# EasyEDA Pro project rhythkey_V1.eprj

# Schematic Schematic1
Board Name: Board1; Create Date: 2024-12-12; Page Name: P1; Project Name: rhythkey_V1; Schematic Name: Schematic1; Update Date: 2024-12-18; Company: 嘉立创EDA; Page Size: A4; Version: V1.0
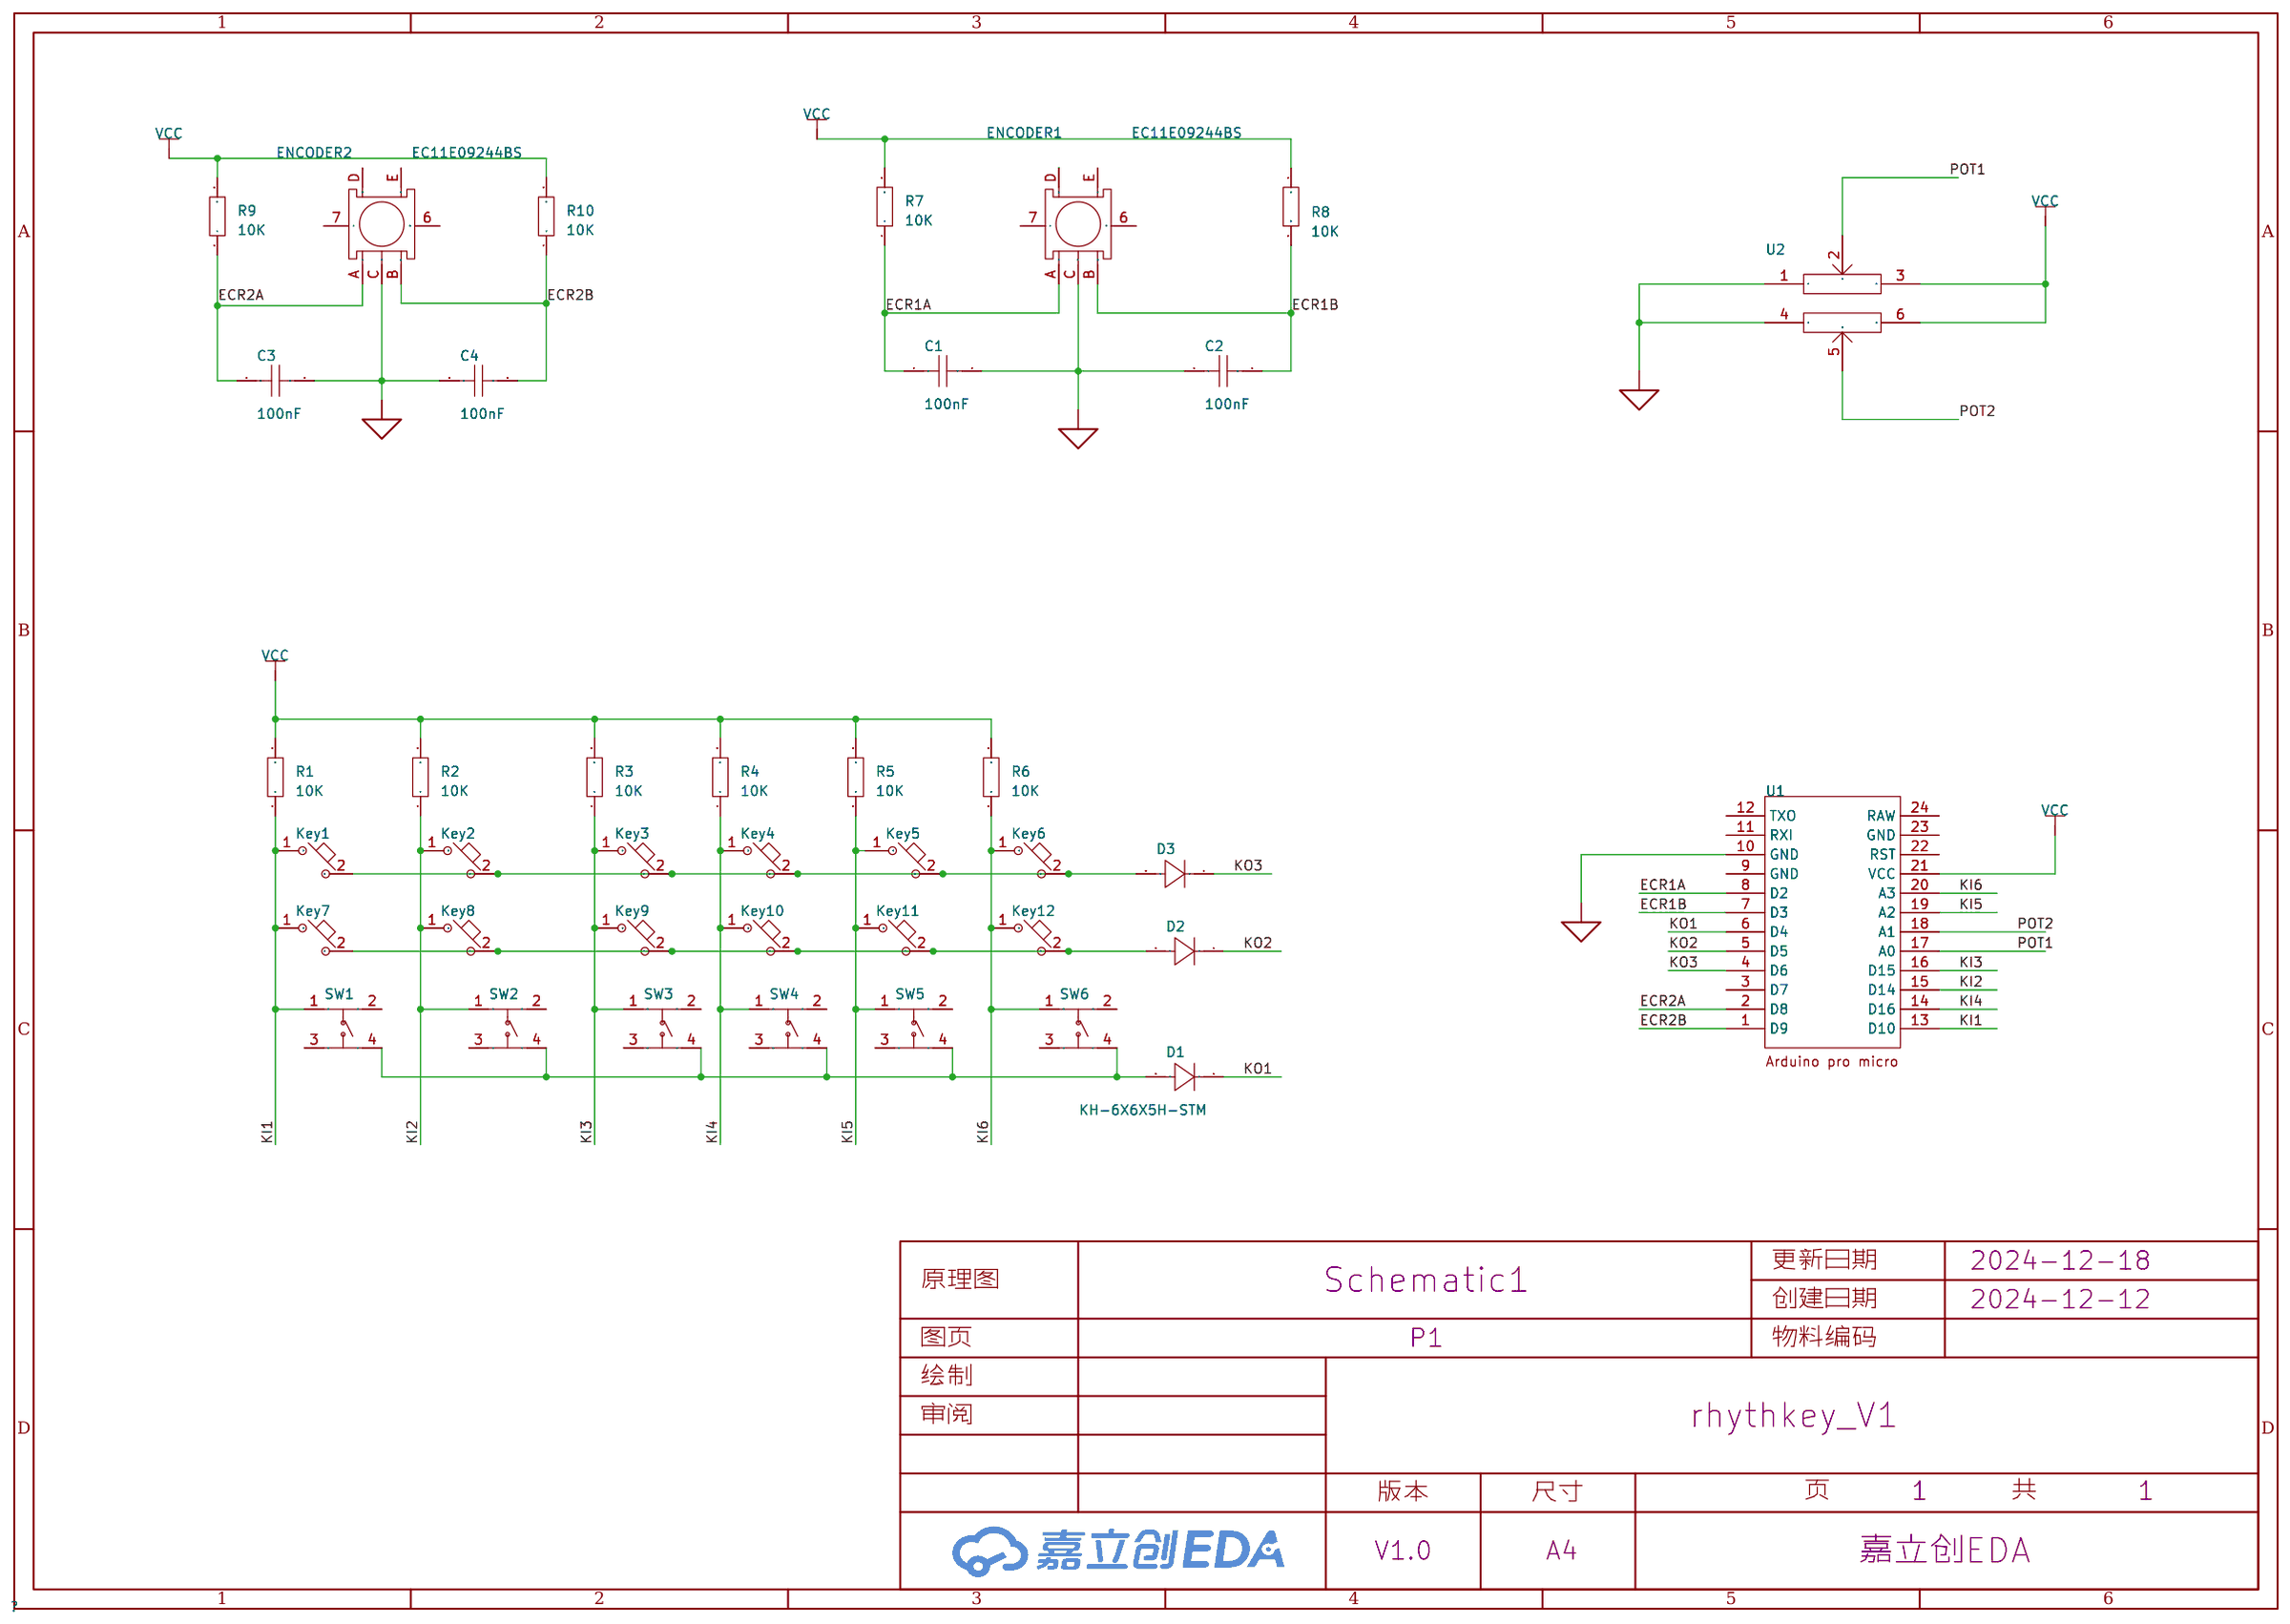
[diagram p0: schematic sheet]

## Parts
C1  100nF  [C0805]
C2  100nF  [C0805]
C3  100nF  [C0805]
C4  100nF  [C0805]
D1  -  [SMA_1N4007]
D2  -  [SMA_1N4007]
D3  -  [SMA_1N4007]
ENCODER1  EC11E09244BS  [SW-TH_EC11XXXXXXXX]
ENCODER2  EC11E09244BS  [SW-TH_EC11XXXXXXXX]
Key1  -  [轴座_焊接热插拔_不带灯]
Key2  -  [轴座_焊接热插拔_不带灯]
Key3  -  [轴座_焊接热插拔_不带灯]
Key4  -  [轴座_焊接热插拔_不带灯]
Key5  -  [轴座_焊接热插拔_不带灯]
Key6  -  [轴座_焊接热插拔_不带灯]
Key7  -  [轴座_焊接热插拔_不带灯]
Key8  -  [轴座_焊接热插拔_不带灯]
Key9  -  [轴座_焊接热插拔_不带灯]
Key10  -  [轴座_焊接热插拔_不带灯]
Key11  -  [轴座_焊接热插拔_不带灯]
Key12  -  [轴座_焊接热插拔_不带灯]
R1  10K  [R0805]
R2  10K  [R0805]
R3  10K  [R0805]
R4  10K  [R0805]
R5  10K  [R0805]
R6  10K  [R0805]
R7  10K  [R0805]
R8  10K  [R0805]
R9  10K  [R0805]
R10  10K  [R0805]
SW1  KH-6X6X5H-STM  [SW-SMD_4P-L6.0-W6.0-P4.50-LS9.0-2]
SW2  KH-6X6X5H-STM  [SW-SMD_4P-L6.0-W6.0-P4.50-LS9.0-2]
SW3  KH-6X6X5H-STM  [SW-SMD_4P-L6.0-W6.0-P4.50-LS9.0-2]
SW4  KH-6X6X5H-STM  [SW-SMD_4P-L6.0-W6.0-P4.50-LS9.0-2]
SW5  KH-6X6X5H-STM  [SW-SMD_4P-L6.0-W6.0-P4.50-LS9.0-2]
SW6  KH-6X6X5H-STM  [SW-SMD_4P-L6.0-W6.0-P4.50-LS9.0-2]
U1  -  [arduino_pro_micro]
U2  -  [75mm 滑台电位器]

## Library data of the parts
C1-C4 = CAP_0805: Supplier Footprint: 0805
D1-D3 = D_1N4007: Supplier Footprint: SMA
ENCODER1 ENCODER2 = EC11E09244BS: Supplier Part: C470742; Manufacturer: ALPSALPINE(阿尔卑斯阿尔派); Supplier Footprint: 插件; JLCPCB Part Class: 扩展库; Datasheet: https://atta.szlcsc.com/upload/public/pdf/source/20191216/C470795_DE763ECE59BD49533DB26DB53E5D34B2.pdf; Supplier: LCSC
Key1-Key12 = 5脚轴座
R1-R6 = Res_0603: Supplier Footprint: 0603
R7-R10 = Res_0805: Supplier Footprint: 0805
SW1-SW6 = KH-6X6X5H-STM: LCSC Part Name: 6*6*5mm 立贴 轻触开关; Supplier Part: C2837531; Manufacturer: kinghelm(金航标); Supplier Footprint: SMD; JLCPCB Part Class: 扩展库; Datasheet: https://atta.szlcsc.com/upload/public/pdf/source/20210608/C2837531_45E87AB996CE723B09405FF2EA209C4C.pdf; Supplier: LCSC; Circuit: 单刀单掷; Actuator Style: 圆形按钮; Mounting Style: 立贴; Switch Length: 6mm; Switch Width: 6mm; Switch Height: 5mm; Strike Gundam: 不带; Contact Current: 50mA; Voltage Rating (DC): 12V; Actuator/Cap Color: 黑色; Pin Style: 鸥翼型; Mechanical Life: 8万次
U1 = arduino_pro_micro: URL: https://www.sparkfun.com/products/12640
U2 = 75mm直滑电位器

## Nets
AGND: C1.2 C2.1 C3.2 C4.1 ENCODER1.C ENCODER2.C U1.10(GND) U2.1 U2.4
VCC: R1.2 R2.2 R3.2 R4.2 R5.2 R6.2 R7.2 R8.1 R9.2 R10.2 U1.21(VCC) U2.3(2) U2.6(3)
ECR1A: C1.1 ENCODER1.A R7.1 U1.8(D2)
ECR1B: C2.2 ENCODER1.B R8.2 U1.7(D3)
ECR2A: C3.1 ENCODER2.A R9.1 U1.2(D8)
ECR2B: C4.2 ENCODER2.B R10.1 U1.1(D9)
KI1: Key1.1(2) Key7.1(2) R1.1 SW1.1 U1.13(D10)
KI2: Key2.1(2) Key8.1(2) R2.1 SW2.1 U1.15(D14)
KI3: Key3.1(2) Key9.1(2) R3.1 SW3.1 U1.16(D15)
KI4: Key4.1(2) Key10.1(2) R4.1 SW4.1 U1.14(D16)
KI5: Key5.1(2) Key11.1(2) R5.1 SW5.1 U1.19(A2)
KI6: Key6.1(2) Key12.1(2) R6.1 SW6.1 U1.20(A3)
KO1: D1.1(K) U1.6(D4)
KO2: D2.1(K) U1.5(D5)
KO3: D3.1(K) U1.4(D6)
POT1: U1.17(A0) U2.2(5)
POT2: U1.18(A1) U2.5(6)
$1N1479: D3.2(A) Key1.2(1) Key2.2(1) Key3.2(1) Key4.2(1) Key5.2(1) Key6.2(1)
$1N1489: D2.2(A) Key7.2(1) Key8.2(1) Key9.2(1) Key10.2(1) Key11.2(1) Key12.2(1)
$1N6551: D1.2(A) SW1.4 SW2.4 SW3.4 SW4.4 SW5.4 SW6.4

Not connected (* = marked no-connect by the designer): ENCODER1 6 7 D E; ENCODER2 6 7 D E; SW1 2 3; SW2 2 3; SW3 2 3; SW4 2 3; SW5 2 3; SW6 2 3; U1 3(D7) 9(GND) 11(RXI) 12(TXO) 22(RST) 23(GND) 24(RAW)

# Board PCB1
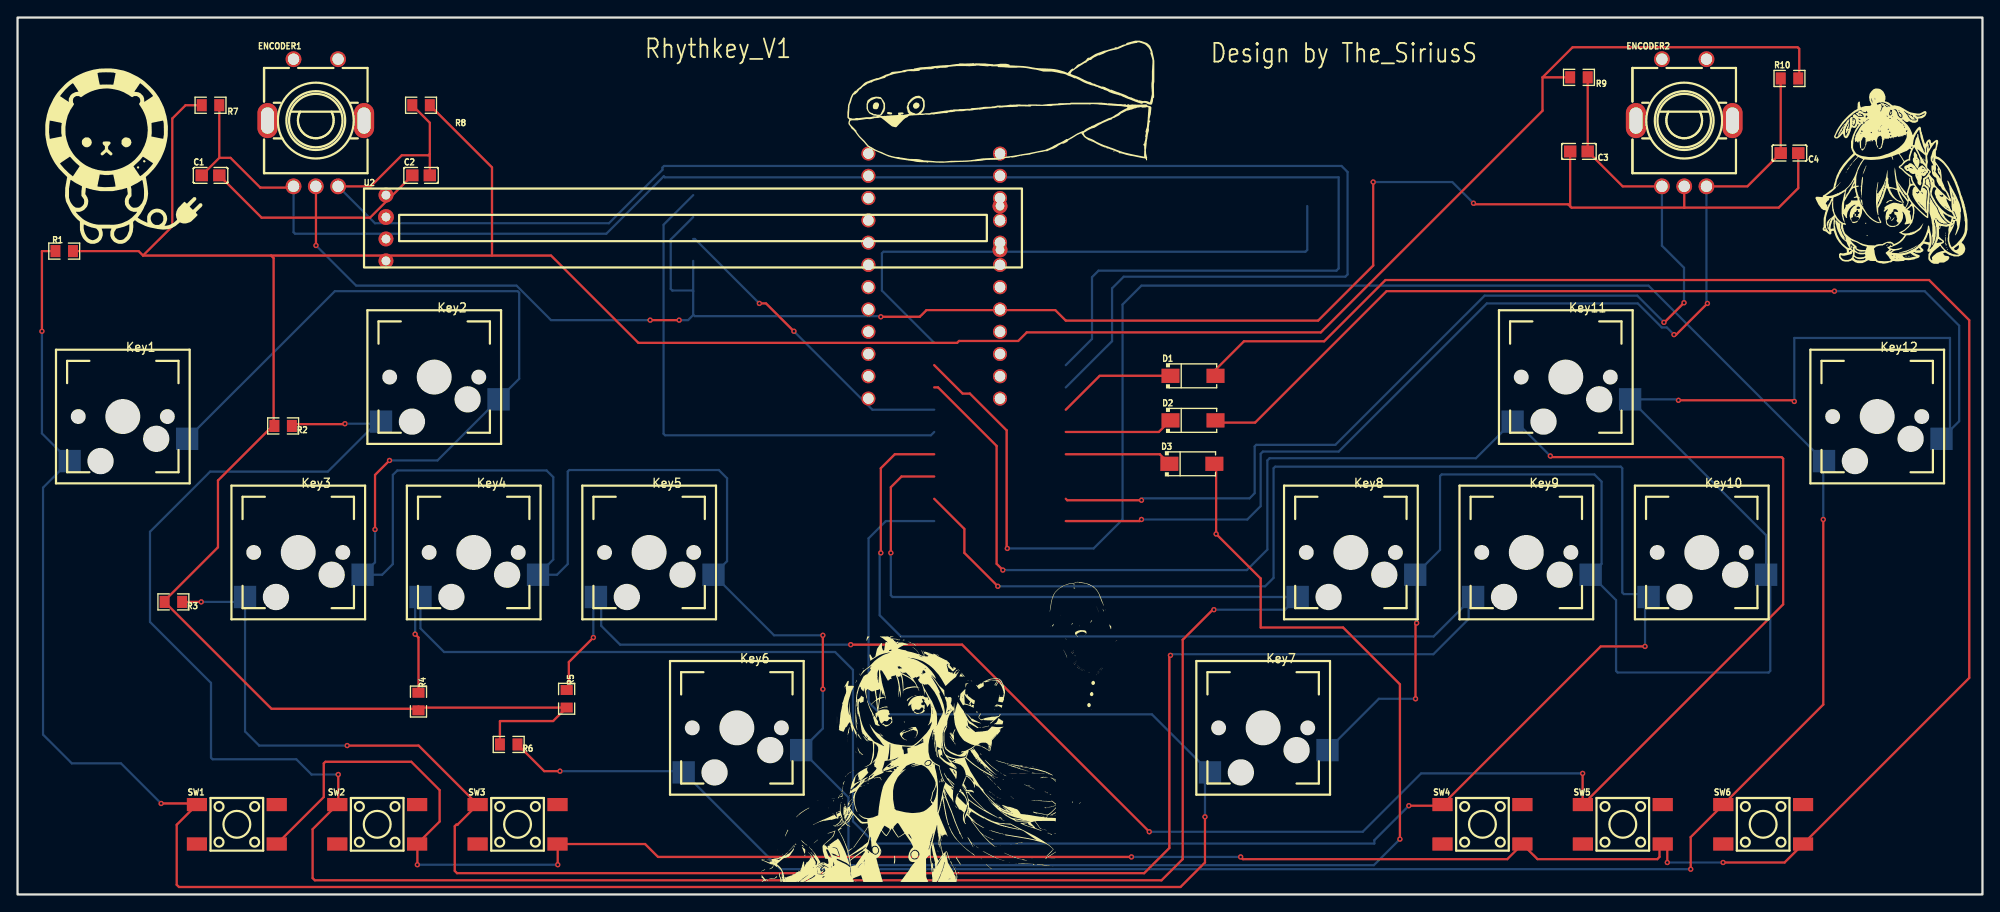
[diagram p1: board, top side]
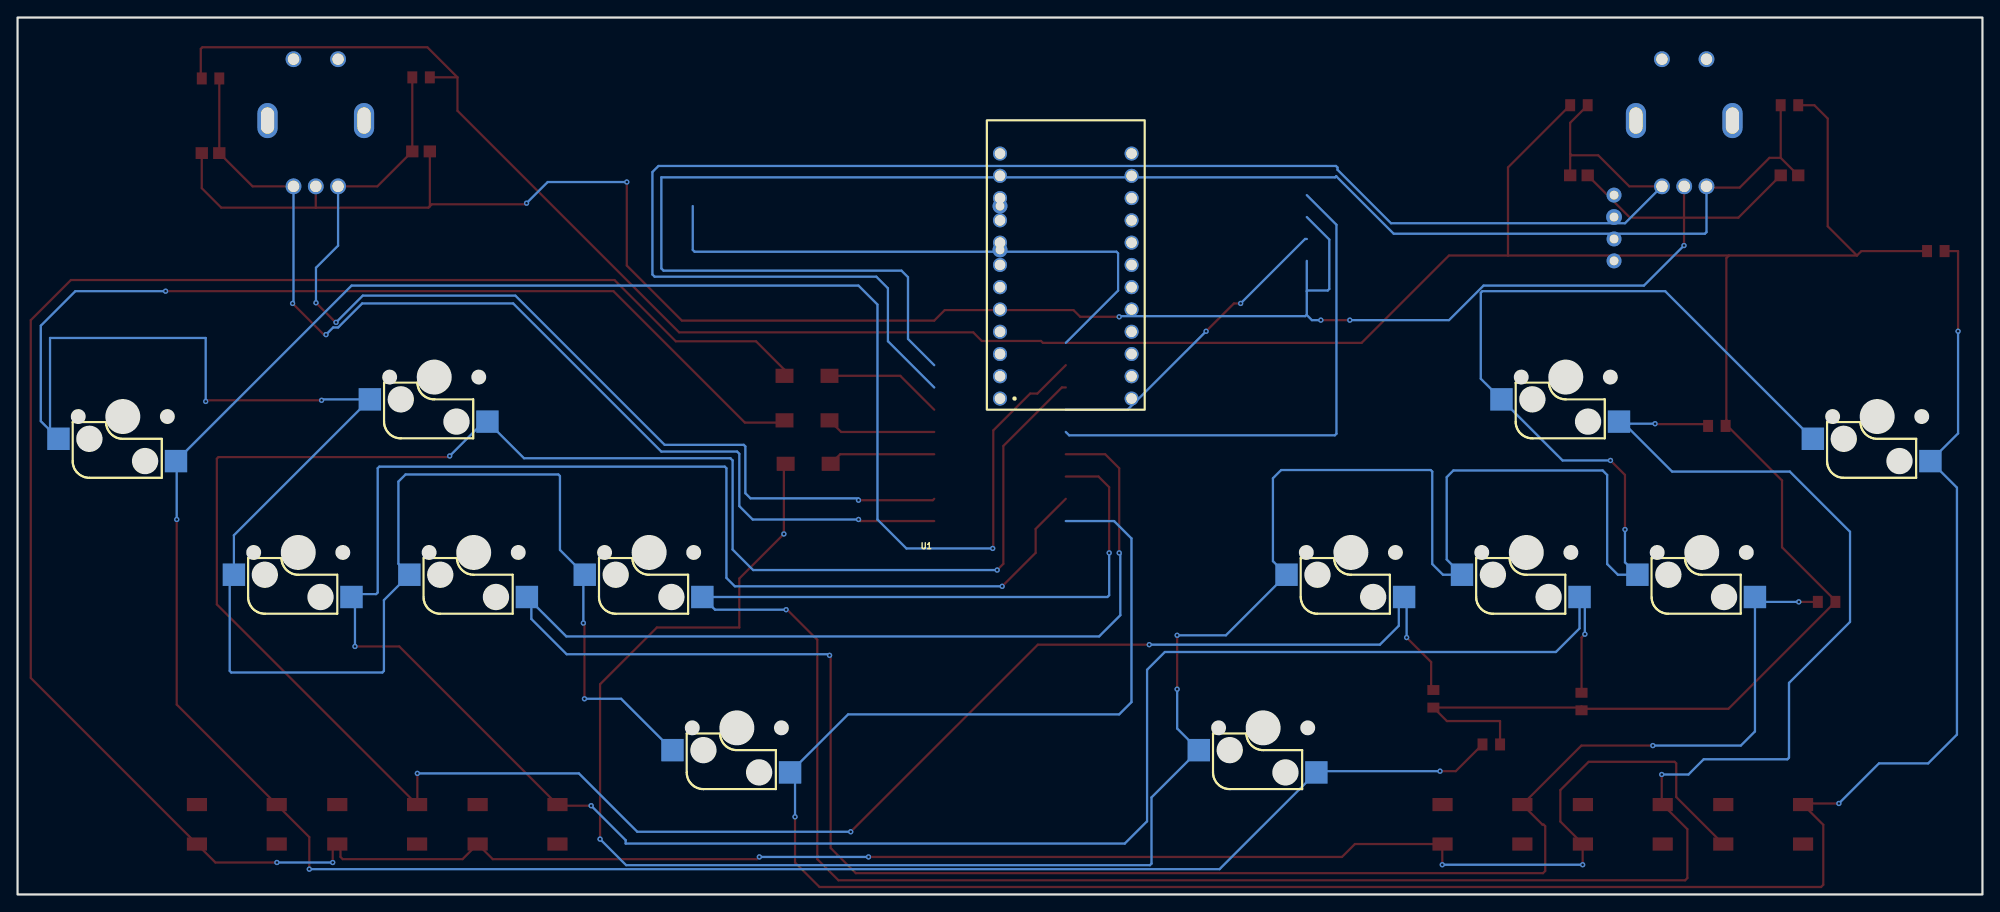
[diagram p2: board, bottom side, seen from below]

Outline 224 x 100 mm; copper layers: Top Layer, Bottom Layer. Coordinates in mm from the lower left corner of the outline.
Outline path: rectangle 0,100 224,0
Stack: Top Layer 0.035mm / Dielectric1 1.51mm FR4 er 4.5 / Bottom Layer 0.035mm

## Design rules (mm)
template: JLCPCB Capability(Two Layers Board)
spacing copperThickness1oz (default): track to track 0.102, other pairs 0.152 to 0.3
spacing copperThickness2oz: track to track 0.203, other pairs 0.152 to 0.3
track width copperThickness1oz (default): min 0.127, default 0.254, max 2.54
track width copperThickness2oz: min 0.203, default 0.254, max 2.54
differential pair differentialPair (default): width min 0.127, default 0.254, max 2.54; gap min 0.152, default 0.152
via viaSize (default): diameter min 0.5, default 0.61, max 10; hole min 0.3, default 0.305, max 6.3

## Placement (name value [footprint] x y rotation side)
C1  100nF  [C0805]  22 82 0 top
C2  100nF  [C0805]  46 82 0 top
C3  100nF  [C0805]  178 84.73 180 top
C4  100nF  [C0805]  202 84.54 180 top
D1  -  [SMA_1N4007]  134 59.14 0 top
D2  -  [SMA_1N4007]  134 54.06 0 top
D3  -  [SMA_1N4007]  133.87 49.11 0 top
ENCODER1  EC11E09244BS  [SW-TH_EC11XXXXXXXX]  34 88 0 top
ENCODER2  EC11E09244BS  [SW-TH_EC11XXXXXXXX]  190 88 0 top
Key1  -  [轴座_焊接热插拔_不带灯]  12 54.5 0 top
Key2  -  [轴座_焊接热插拔_不带灯]  47.5 59 0 top
Key3  -  [轴座_焊接热插拔_不带灯]  32 39 0 top
Key4  -  [轴座_焊接热插拔_不带灯]  52 39 0 top
Key5  -  [轴座_焊接热插拔_不带灯]  72 39 0 top
Key6  -  [轴座_焊接热插拔_不带灯]  82 19 0 top
Key7  -  [轴座_焊接热插拔_不带灯]  142 19 0 top
Key8  -  [轴座_焊接热插拔_不带灯]  152 39 0 top
Key9  -  [轴座_焊接热插拔_不带灯]  172 39 0 top
Key10  -  [轴座_焊接热插拔_不带灯]  192 39 0 top
Key11  -  [轴座_焊接热插拔_不带灯]  176.5 59 0 top
Key12  -  [轴座_焊接热插拔_不带灯]  212 54.5 0 top
R1  10K  [R0805]  5.32 73.37 0 top
R2  10K  [R0805]  30.28 53.43 180 top
R3  10K  [R0805]  17.77 33.36 180 top
R4  10K  [R0805]  45.71 22 270 top
R5  10K  [R0805]  62.6 22.31 270 top
R6  10K  [R0805]  55.99 17.11 180 top
R7  10K  [R0805]  22 90 180 top
R8  10K  [R0805]  46 90 180 top
R9  10K  [R0805]  178 93.18 180 top
R10  10K  [R0805]  202 93.05 0 top
SW1  KH-6X6X5H-STM  [SW-SMD_4P-L6.0-W6.0-P4.50-LS9.0-2]  25 8 0 top
SW2  KH-6X6X5H-STM  [SW-SMD_4P-L6.0-W6.0-P4.50-LS9.0-2]  41 8 0 top
SW3  KH-6X6X5H-STM  [SW-SMD_4P-L6.0-W6.0-P4.50-LS9.0-2]  57 8 0 top
SW4  KH-6X6X5H-STM  [SW-SMD_4P-L6.0-W6.0-P4.50-LS9.0-2]  167 8 0 top
SW5  KH-6X6X5H-STM  [SW-SMD_4P-L6.0-W6.0-P4.50-LS9.0-2]  183 8 0 top
SW6  KH-6X6X5H-STM  [SW-SMD_4P-L6.0-W6.0-P4.50-LS9.0-2]  199 8 0 top
U1  -  [arduino_pro_micro]  112 56.55 180 bottom
U2  -  [75mm 滑台电位器]  112 76 0 top

## Footprints (pads in the part's own frame, mm; a bottom-side part is the same pattern mirrored in y, then rotated)
75mm 滑台电位器
  round 1.8 hole 1: 1(-70,1.25)
  round 1.7 hole 1: 2(-70,3.75) 3(0,2.5) 4(-70,-3.75) 5(-70,-1.25) 6(0,-2.5)
arduino_pro_micro
  round 1.6 hole 1.2x1: 1(0,0) 2(0,2.54) 3(0,5.08) 4(0,7.62) 5(0,10.16) 6(0,12.7) 7(0,15.24) 8(0,17.78) 9(0,20.32) 10(0,22.86) 11(0,25.4) 12(0,27.94) 13(15,0) 14(15,2.54) 15(15,5.08) 16(15,7.62) 17(15,10.16) 18(15,12.7) 19(15,15.24) 20(15,17.78) 21(15,20.32) 22(15,22.86) 23(15,25.4) 24(15,27.94)
C0805
  rect 1.41x1.35 smd: 1(-1,0) 2(1,0)
R0805
  rect 1.133x1.377 smd: 1(-1,0) 2(1,0)
SMA_1N4007
  rect 2.046x1.62 smd: 1(-2.566,0) 2(2.566,0)
SW-SMD_4P-L6.0-W6.0-P4.50-LS9.0-2
  rect 2.3x1.5 smd: 1(-4.55,2.25) 2(4.55,2.25) 3(-4.55,-2.25) 4(4.55,-2.25)
SW-TH_EC11XXXXXXXX
  oval 2.3x4 hole 1.5x3: 6(5.5,0.25) 7(-5.5,0.25)
  round 1.8 hole 1.3: A(-2.54,-7.25) B(2.54,-7.25) C(0,-7.25) D(-2.54,7.25) E(2.54,7.25)
轴座_焊接热插拔_不带灯
  rect 2.55x2.55 smd far side: 1(-6.066,-5.08) 2(7.335,-2.54)

## Nets
As in the schematic.

Pads without a net: ENCODER1 6 7 E; ENCODER2 6 7; SW1 2 3; SW2 2 3; SW3 2 3; SW4 2 3; SW5 2 3; SW6 2 3; U1 3 9 11 12 22 23 24

## Via types
v1: diameter 0.61, hole 0.305, Top Layer to Bottom Layer, 56 vias

## Routing (per net, layer and track width the routed paths; a pad name or vN(x,y) marks a point on that pad's centre or on a via; arc(x,y) is an arc through that point)
AGND: length 251.3
  Top Layer w0.254: v1(165.97,78.83) 166.1,78.7 176.77,78.7 177,78.47 ; C3.2 177,78.47 ; 177,78.47 177.15,78.32 190,78.32 190,78.35 ; 34.02,77.18 v1(34.02,74) ; 34.02,77.18 34.02,80.73 ENCODER1.C ; 34.02,77.18 27.82,77.18 C1.2 ; 34.02,77.18 40.18,77.18 C2.1 ; ENCODER2.C 190,78.35 ; 190,78.35 190.03,78.32 200.77,78.32 203,80.55 C4.1 ; v1(154.54,81.24) 154.54,71.72 148.27,65.44 119.5,65.44 118.3,66.64 103.62,66.64 102.86,65.88 v1(98.41,65.88) ; v1(72.12,65.49) v1(75.42,65.49)
  Bottom Layer w0.254: v1(34.02,74) 38.59,69.43 56.88,69.43 60.81,65.49 v1(72.12,65.49) ; 77.03,72.25 77.03,68.8 ; 77.03,68.8 77.03,66.13 77.2,65.95 98.34,65.95 v1(98.41,65.88) ; 77.03,68.8 76.95,68.87 74.64,68.87 74.46,69.05 74.46,74.69 77.03,77.25 ; v1(154.54,81.24) 163.56,81.24 v1(165.97,78.83) ; 76.95,66 76.44,65.49 v1(75.42,65.49)
VCC: length 438.6
  Top Layer w0.254: 54.09,72.86 54.09,82.91 R8.1 ; 54.09,72.86 28.9,72.86 ; 54.09,72.86 60.82,72.86 70.78,62.9 107.11,62.9 107.33,63.12 114.07,63.12 115.05,64.1 148.58,64.1 173.85,89.37 173.85,93.18 ; 28.9,53.81 R2.2 ; 28.9,53.81 29.2,54.1 29.2,72.56 28.9,72.86 ; 28.9,53.81 28.9,53.26 22.85,47.21 22.85,39.59 16.89,33.63 16.89,33.49 R3.2 28.96,21.17 45.44,21.17 45.71,21.44 ; 45.71,21.31 R5.2 61.06,19.77 54.99,19.77 R6.2 ; 28.9,72.86 14.31,72.86 ; R7.2 19.16,90 17.64,88.48 17.64,76.19 14.31,72.86 ; R10.2 203.11,93.16 203.11,96.43 202.93,96.61 177.28,96.61 173.85,93.18 ; R1.2 13.8,73.37 14.31,72.86 ; 173.85,93.18 R9.2
  Bottom Layer w0.254: 147.03,78.5 147.03,73.5 146.82,73.29 98.72,73.29 98.54,73.11 98.54,68.86 104.5,62.9
ECR1A: length 196.2
  Top Layer w0.254: 23,84 24.28,84 27.67,80.61 31.32,80.61 ENCODER1.A ; 23,84 R7.1 ; 23,84 C1.1
  Bottom Layer w0.254: 119.5,60.36 122.49,63.35 122.49,70.39 123.23,71.13 150.35,71.13 150.61,71.39 150.61,81.78 73.8,81.78 73.67,81.91 67.12,75.35 31.64,75.35 31.46,75.53 ENCODER1.A
ECR1B: length 193.4
  Top Layer w0.254: R8.2 47,88 47,84.42 ; 47,84.42 46.98,84.42 46.85,84.29 43.8,84.29 40.26,80.75 ENCODER1.B ; 47,84.42 C2.2
  Bottom Layer w0.254: 119.5,57.82 124.77,63.09 124.77,69.12 126.1,70.45 151.37,70.45 151.62,70.7 151.62,82.39 150.94,83.07 73.7,83.07 73.52,82.89 73.52,82.64 67.42,76.54 40.75,76.54 ENCODER1.B
ECR2A: length 118.3
  Top Layer w0.254: 119.5,45.12 119.66,44.96 v1(128.13,44.96) ; R9.1 C3.1 182.98,80.75 ENCODER2.A ; v1(189.98,67.47) 187.74,65.24 v1(187.69,65.24)
  Bottom Layer w0.254: v1(189.98,67.47) 189.98,71.46 187.46,73.98 ENCODER2.A ; 128.13,45.17 140.45,45.17 141.03,45.76 141.03,51.09 141.21,51.27 150.23,51.27 167.25,68.29 184.64,68.29 v1(187.69,65.24)
ECR2B: length 121.8
  Top Layer w0.254: ENCODER2.B 197.21,80.75 C4.2 R10.1 ; v1(128.13,42.76) 127.95,42.58 119.5,42.58 ; v1(192.65,67.4) 189.09,63.84 v1(188.84,63.84)
  Bottom Layer w0.254: v1(192.65,67.4) 192.54,67.5 ENCODER2.B ; v1(128.13,42.76) 140.19,42.76 141.72,44.28 141.72,50.25 141.97,50.51 150.61,50.51 167.5,67.4 184.71,67.4 187.45,64.66 188.02,64.66 v1(188.84,63.84)
KI1: length 288.4
  Top Layer w0.254: v1(16.37,10.38) 20.32,10.38 SW1.1 18.15,7.95 18.15,1.1 18.4,0.85 132.57,0.85 135.37,3.65 v1(135.37,8.85) ; v1(2.78,64.22) 2.78,73.37 R1.1
  Bottom Layer w0.254: v1(2.78,64.22) 2.78,52.57 Key1.1 2.91,46.39 2.91,18.23 6.19,14.95 11.8,14.95 v1(16.37,10.38) ; v1(135.37,8.85) 135.37,13.35 Key7.1 129.32,20.54 98.41,20.54 97.01,21.93 97.01,40.6 98.99,42.58 104.5,42.58
KI2: length 301.9
  Top Layer w0.254: v1(36.56,13.68) 36.56,10.36 SW2.1 33.64,7.44 33.64,1.87 33.89,1.61 130.41,1.61 132.83,4.03 132.83,29.04 136.26,32.47 v1(136.38,32.47) ; v1(37.32,53.68) 37.28,53.64 31.48,53.64 R2.1 ; 104.5,47.66 100.77,47.66 99.55,46.44 v1(99.55,38.95)
  Bottom Layer w0.254: Key2.1 41.2,53.68 40.27,53.68 ; v1(37.32,53.68) 40.27,53.68 ; 40.27,53.68 40.27,53.62 40.52,53.37 35.38,48.22 21.96,48.22 15.1,41.36 15.1,31.08 22.05,24.12 22.05,15.6 22.23,15.42 31.78,15.42 33.51,13.68 v1(36.56,13.68) ; v1(99.55,38.95) 99.55,34.12 99.76,33.92 144.97,33.92 145.45,33.44 144.49,32.47 v1(136.38,32.47)
KI3: length 298
  Top Layer w0.254: 104.5,50.2 100.01,50.2 98.41,48.6 v1(98.41,38.95) ; v1(37.58,16.98) 45.72,16.98 SW3.1 50.16,7.96 50.02,7.96 49.84,7.78 49.84,2.68 50.1,2.43 128.44,2.43 131.3,5.3 131.3,27.14 v1(131.43,27.27) ; v1(20.94,33.36) R3.1
  Bottom Layer w0.254: 165.43,33.41 Key9.1 ; 165.43,33.41 165.43,31.42 161.4,27.39 131.56,27.39 v1(131.43,27.27) ; 165.43,33.41 161.44,29.43 100.7,29.43 98.28,31.84 98.28,38.82 v1(98.41,38.95) ; v1(37.58,16.98) 27.55,16.98 25.93,18.59 Key3.1 25.38,33.36 v1(20.94,33.36)
KI4: length 304.3
  Top Layer w0.254: 45.71,23.44 45.71,29.3 v1(45.33,29.68) ; 104.5,45.12 107.94,41.68 107.94,38.96 v1(111.75,35.14) ; v1(185.53,28.28) 180.48,28.28 SW4.1 162.32,10.12 v1(158.61,10.12)
  Bottom Layer w0.254: v1(111.75,35.14) 142.23,35.14 143.19,36.1 143.19,48.6 143.37,48.78 182.76,48.78 182.94,48.6 182.94,34.43 183.12,34.25 185.6,34.25 Key10.1 185.53,33.52 v1(185.53,28.28) ; v1(45.33,29.68) 45.33,33.31 Key4.1 45.93,30.34 48.63,27.65 93.2,27.65 95.24,25.62 95.24,8.34 97.78,5.8 154.67,5.8 154.67,6.19 v1(158.61,10.12)
KI5: length 320.5
  Top Layer w0.254: 104.5,57.82 104.94,57.82 111.62,51.14 111.62,37.7 v1(112.33,36.99) ; v1(65.64,29.3) 62.85,26.5 62.85,23.57 R5.1 ; v1(174.74,50) 174.87,49.87 201.1,49.87 201.28,49.69 201.28,33.08 SW5.1 178.42,10.28 v1(178.42,13.81) ; v1(129.02,7.15) 107.68,28.49 v1(94.98,28.49)
  Bottom Layer w0.254: v1(65.64,29.3) 65.64,33.63 Key5.1 66.19,33.92 66.53,33.57 66.53,30.64 68.69,28.49 v1(94.98,28.49) ; v1(129.02,7.15) 153.35,7.15 160.01,13.81 v1(178.42,13.81) ; v1(112.33,36.99) 140.14,36.99 142.48,39.33 142.48,49.49 142.73,49.75 166.26,49.75 Key11.1 170.82,53.92 v1(174.74,50)
KI6: length 345.5
  Top Layer w0.254: v1(205.85,42.76) 205.85,21.65 SW6.1 190.74,6.54 v1(190.74,2.88) ; v1(112.83,39.46) 112.76,39.53 112.76,52.92 108.56,57.12 107.74,57.12 104.5,60.36 ; R6.1 60.04,14.06 v1(61.83,14.06)
  Bottom Layer w0.254: v1(190.74,2.88) 86.97,2.88 Key6.1 75.8,14.06 v1(61.83,14.06) ; v1(205.85,42.76) 205.85,49.34 Key12.1 185.92,69.43 128.13,69.43 125.97,67.27 125.97,42.76 122.67,39.46 v1(112.83,39.46)
KO1: length 13.5
  Top Layer w0.254: 119.5,55.28 123.36,59.14 D1.1
KO2: length 12.5
  Top Layer w0.254: 119.5,52.74 130.11,52.74 D2.1
KO3: length 12.3
  Top Layer w0.254: 119.5,50.2 130.22,50.2 D3.1
POT1: length 59.7
  Bottom Layer w0.254: 77.03,79.75 73.65,76.37 73.65,52.54 73.83,52.36 104.12,52.36 104.5,52.74
POT2: length 35.4
  Top Layer w0.254: v1(84.57,67.4) 85.33,67.4 v1(88.5,64.22)
  Bottom Layer w0.254: v1(88.5,64.22) 97.45,55.28 104.5,55.28 ; 77.03,74.75 77.22,74.75 84.44,67.53
$1N1479: length 343
  Top Layer w0.254: D3.2 136.64,48.91 v1(136.64,41.11) 141.72,36.03 141.72,30.44 151.12,30.44 157.59,23.97 v1(157.59,6.31) ; v1(91.81,29.55) v1(91.81,23.41) ; v1(42.4,49.49) 40.75,47.84 v1(40.75,41.62)
  Bottom Layer w0.254: v1(91.81,29.55) 86.24,29.55 Key5.2 80.89,38.01 80.89,47.46 79.94,48.4 62.9,48.4 62.72,48.22 62.72,37.68 61.5,36.46 Key4.2 61.07,38.2 61.07,47.59 60.31,48.35 43.29,48.35 42.78,47.84 42.78,37.68 41.56,36.46 Key3.2 40.75,37.88 v1(40.75,41.62) ; v1(91.81,23.41) 91.81,18.93 Key6.2 94.73,11.07 94.73,3.52 94.91,3.34 154.62,3.34 v1(157.59,6.31) ; v1(42.4,49.49) 47.87,49.49 Key2.2 57.19,58.81 57.19,68.62 57.01,68.8 36.17,68.8 Key1.2
$1N1489: length 297.4
  Top Layer w0.254: v1(159.5,30.95) 159.37,30.82 v1(159.37,22.31) ; v1(189.34,56.35) 202.42,56.35 v1(202.55,56.22) ; v1(207.12,68.8) 156.07,68.8 141.08,53.81 137.33,53.81 137.07,54.06 D2.2
  Bottom Layer w0.254: v1(207.12,68.8) 217.41,68.8 221.35,64.86 221.35,53.97 220.3,52.92 ; 220.3,52.92 220.3,63.46 202.55,63.46 v1(202.55,56.22) ; 220.3,52.92 Key12.2 ; v1(159.5,30.95) 159.5,36.3 Key8.2 162.16,39.29 162.16,47.71 162.34,47.89 179.77,47.89 180.58,47.08 180.58,37.7 Key9.2 182.23,33.56 182.23,25.49 182.41,25.31 199.63,25.31 199.81,25.49 199.81,35.99 Key10.2 199.34,40.96 Key11.2 189.23,56.46 v1(189.34,56.35) ; Key7.2 155.19,22.31 v1(159.37,22.31)
$1N6551: length 362.4
  Top Layer w0.254: v1(139.43,4.28) 139.69,4.03 169.83,4.03 SW4.4 173.27,4.03 186.93,4.03 187.18,4.28 187.18,5.38 SW5.4 188.07,5.23 188.07,3.77 ; D1.2 136.57,59.83 139.81,63.08 148.96,63.08 155.94,70.07 217.92,70.07 222.49,65.49 222.49,24.69 SW6.4 201.44,3.65 v1(194.43,3.65) ; v1(61.58,3.39) 61.58,5.72 SW3.4 71.54,5.75 73.01,4.28 v1(126.99,4.28) ; v1(45.58,3.39) 45.58,5.72 SW2.4 48.12,8.32 48.12,11.9 44.89,15.13 35.09,15.13 34.91,14.95 34.91,11.11 SW1.4
  Bottom Layer w0.254: v1(188.07,3.65) v1(194.43,3.65) ; v1(126.99,4.28) v1(139.43,4.28) ; v1(45.58,3.39) v1(61.58,3.39)

## Text on the board
Top Silkscreen Layer: Rhythkey_V1 | Design by The_SiriusS
